# EAGLE design shem_v1.1 (EAGLE 5.09)
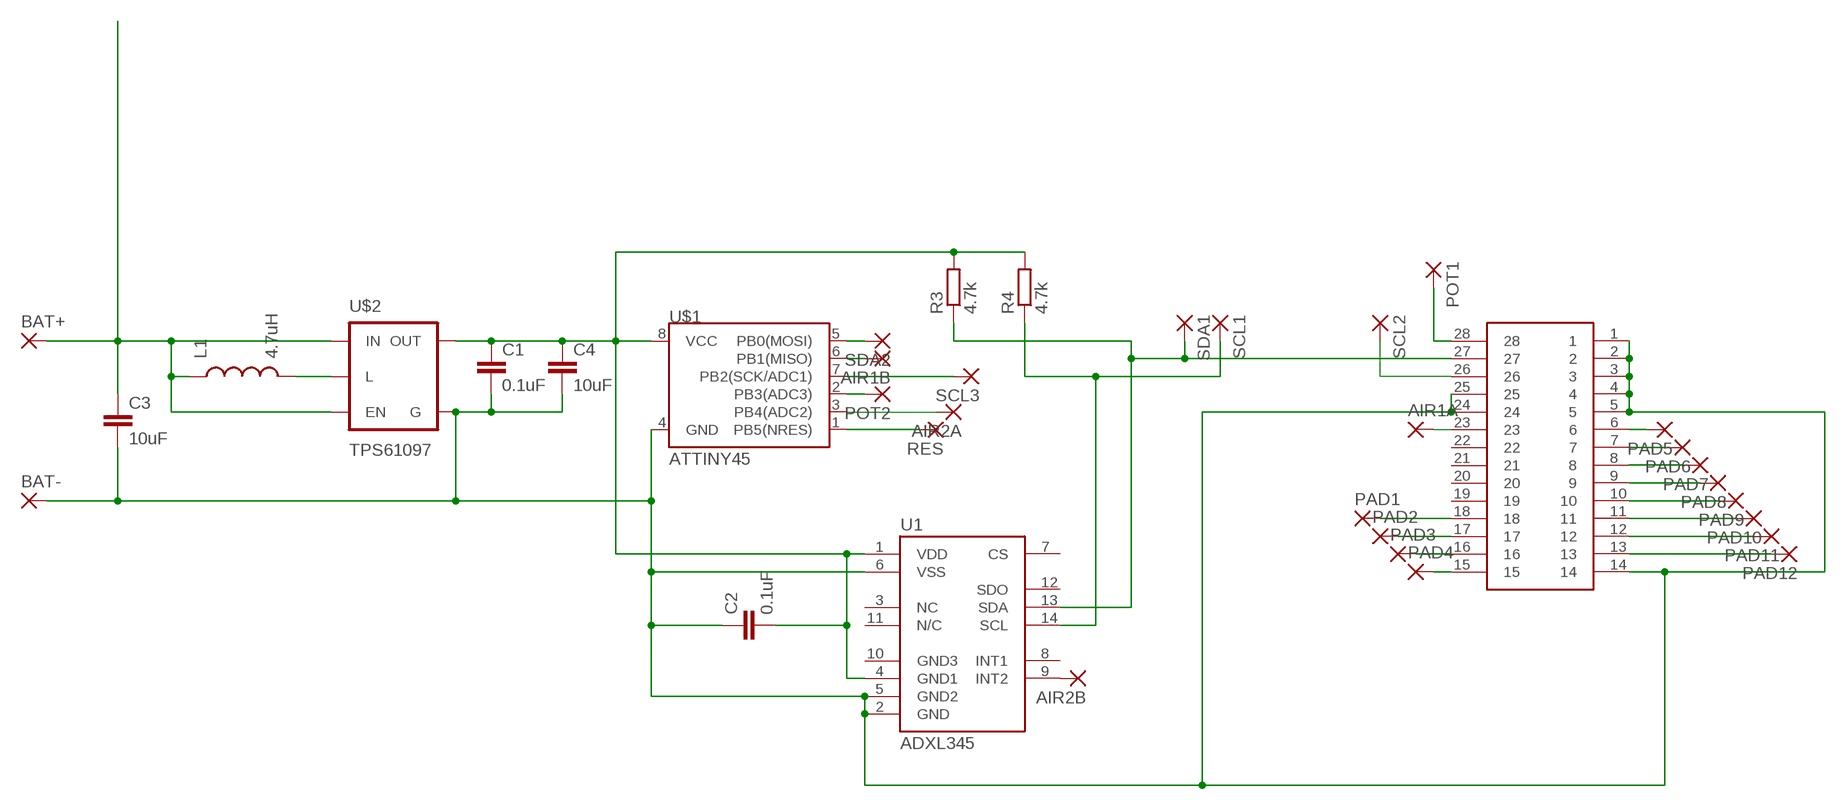
[diagram p0: schematic, sheet 1]

## Parts
AIR1A  SMD5  [SMD2,54-5,08]
AIR1B  SMD5  [SMD2,54-5,08]
AIR2A  SMD5  [SMD2,54-5,08]
AIR2B  SMD5  [SMD2,54-5,08]
BAT+  SMD5  [SMD2,54-5,08]
BAT-  SMD5  [SMD2,54-5,08]
C1  0.1uF  C-EUC1206  [C1206]
C2  0.1uF  C-EUC1206  [C1206]
C3  10uF  C-EUC1206  [C1206]
C4  10uF  C-EUC1206  [C1206]
L1  4.7uH  INDUCTOR1210  [1210]
PAD1  SMD5  [SMD2,54-5,08]
PAD2  SMD5  [SMD2,54-5,08]
PAD3  SMD5  [SMD2,54-5,08]
PAD4  SMD5  [SMD2,54-5,08]
PAD5  SMD5  [SMD2,54-5,08]
PAD6  SMD5  [SMD2,54-5,08]
PAD7  SMD5  [SMD2,54-5,08]
PAD8  SMD5  [SMD2,54-5,08]
PAD9  SMD5  [SMD2,54-5,08]
PAD10  SMD5  [SMD2,54-5,08]
PAD11  SMD5  [SMD2,54-5,08]
PAD12  SMD5  [SMD2,54-5,08]
PCA9635  SSOP28  [SSOP28DB]
POT1  SMD5  [SMD2,54-5,08]
POT2  SMD5  [SMD2,54-5,08]
R3  4.7k  R-EU_M0805  [M0805]
R4  4.7k  R-EU_M0805  [M0805]
RES  SMD5  [SMD2,54-5,08]
SCL1  SMD5  [SMD2,54-5,08]
SCL2  SMD5  [SMD2,54-5,08]
SCL3  SMD5  [SMD2,54-5,08]
SDA1  SMD5  [SMD2,54-5,08]
SDA2  SMD5  [SMD2,54-5,08]
U1  ADXL345  [LGA14]
U$1  ATTINY45  [SO08-EIAJ]
U$2  TPS61097  [SOT23-5]

## Nets
N$1: BAT-.1(P) C1.2 C2.1 C3.2 C4.2 PCA9635.1 PCA9635.2 PCA9635.3 PCA9635.4 PCA9635.5 PCA9635.14 PCA9635.24 PCA9635.25 U1.2(GND) U1.5(GND2) U1.6(VSS) U$1.4(GND) U$2.2(G)
N$2: BAT+.1(P) C3.1 L1.1 U$2.1(IN) U$2.3(EN)
N$3: L1.2 U$2.5(L)
N$4: POT2.1(P) U$1.2(PB3(ADC3))
N$5: C1.1 C2.2 C4.1 R3.2 R4.2 U1.1(VDD) U1.4(GND1) U$1.8(VCC) U$2.4(OUT)
N$6: PCA9635.27 R3.1 SDA1.1(P) U1.13(SDA)
N$7: SCL3.1(P) U$1.7(PB2(SCK/ADC1))
N$8: AIR2B.1(P) U1.9(INT2)
N$9: PCA9635.26 SCL2.1(P)
N$10: PAD5.1(P) PCA9635.6
N$11: PAD6.1(P) PCA9635.7
N$12: PAD7.1(P) PCA9635.8
N$13: PAD8.1(P) PCA9635.9
N$14: PAD9.1(P) PCA9635.10
N$15: PAD10.1(P) PCA9635.11
N$16: PAD11.1(P) PCA9635.12
N$17: PAD12.1(P) PCA9635.13
N$18: PAD1.1(P) PCA9635.18
N$19: PAD2.1(P) PCA9635.17
N$20: PAD3.1(P) PCA9635.16
N$21: PAD4.1(P) PCA9635.15
N$22: RES.1(P) U$1.1(PB5(NRES))
N$23: AIR1A.1(P) PCA9635.23
N$24: AIR2A.1(P) U$1.3(PB4(ADC2))
N$25: R4.1 SCL1.1(P) U1.14(SCL)
N$26: AIR1B.1(P) U$1.6(PB1(MISO))
N$27: PCA9635.28 POT1.1(P)
N$28: SDA2.1(P) U$1.5(PB0(MOSI))
Unconnected: PCA9635.19 PCA9635.20 PCA9635.21 PCA9635.22 U1.3(NC) U1.7(CS) U1.8(INT1) U1.10(GND3) U1.11(N/C) U1.12(SDO)

## Library data of the parts
AIR1A AIR1B AIR2A AIR2B BAT+ BAT- PAD1-PAD12 POT1 POT2 RES SCL1-SCL3 SDA1 SDA2 = wirepad:SMD5: SMD PAD
C1-C4 = resistor:C-EU: CAPACITOR, European symbol
L1 = SparkFun:INDUCTOR: Inductors Basic Inductor/Choke - 0603 and 1206. Footprints are not proven and vary greatly between part numbers.
PCA9635 = SparkFun:SSOP28
R3 R4 = resistor:R-EU_: RESISTOR, European symbol
U1 = SparkFun:ADXL345
U$1 = SparkFun:ATTINY45: Atmel ATTiny45
U$2 = TPS:TPS61097

## Board
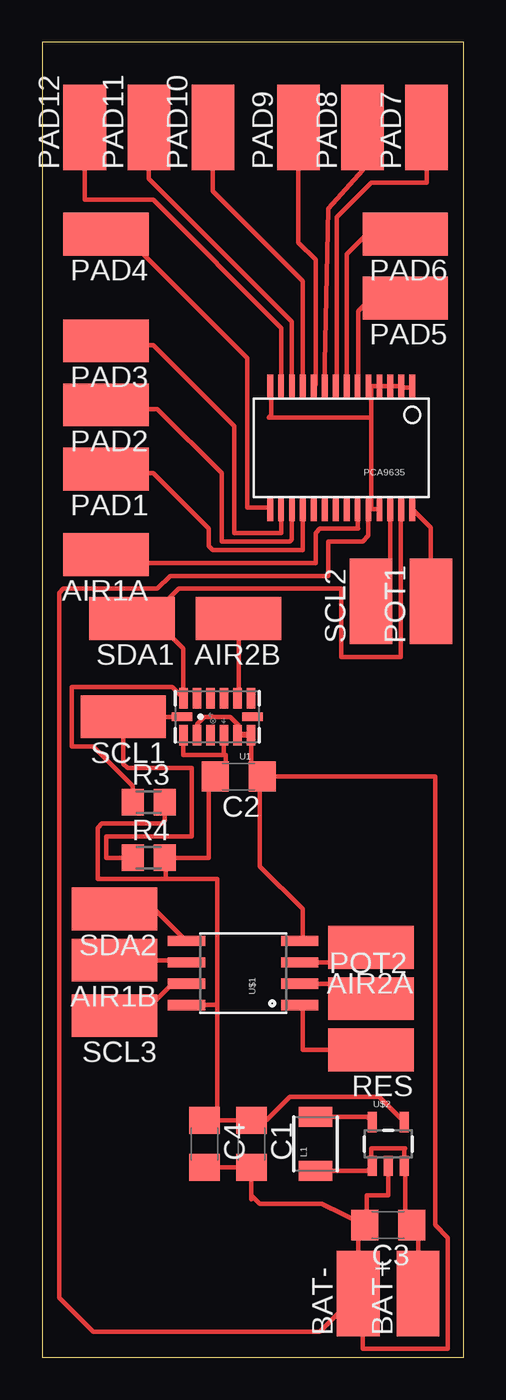
[diagram p1: board, top side]

Size 25.07 x 78.22 mm. Coordinates in mm from the lower left corner, seen from the top.
Outline: 0,0 25.07,0 25.07,78.22 0,78.22 0,0
Copper layers (1*16): Top 0.035mm / dielectric 1.5mm / Bottom 0.035mm
Design rules "default": minimum track width 10mil, minimum drill 24mil, track to track 8mil, track to pad 8mil, pad to pad 8mil, via to via 8mil, smd to smd 8mil, copper to edge 40mil, drill to drill 8mil, minimum pad ring 10mil, minimum via ring 8mil, stop-mask expansion 4mil, vias tented up to drill 0mil, thermal gap 10mil

### Footprints (pad centres in the part's own frame; a part is rotated, then mirrored left to right if it is on the bottom)
SMD2,54-5,08 = smd 2.54 x 5.08: 1 0,0
C1206 = smd 1.6 x 1.8: 1 -1.4,0; 2 1.4,0
1210 = smd 1.2 x 2: 1 -1.6,0; 2 1.6,0
SSOP28DB = smd 0.348 x 1.397: 1 -4.225,-3.656; 2 -3.575,-3.656; 3 -2.925,-3.656; 4 -2.275,-3.656; 5 -1.625,-3.656; 6 -0.975,-3.656; 7 -0.325,-3.656; 8 0.325,-3.656; 9 0.975,-3.656; 10 1.625,-3.656; 11 2.275,-3.656; 12 2.925,-3.656; 13 3.575,-3.656; 14 4.225,-3.656; 15 4.225,3.656; 16 3.575,3.656; 17 2.925,3.656; 18 2.275,3.656; 19 1.625,3.656; 20 0.975,3.656; 21 0.325,3.656; 22 -0.325,3.656; 23 -0.975,3.656; 24 -1.625,3.656; 25 -2.275,3.656; 26 -2.925,3.656; 27 -3.575,3.656; 28 -4.225,3.656
M0805 = smd 1.3 x 1.6: 1 -0.95,0; 2 0.95,0
LGA14 = smd 0.5 x 1.2: 1 2,1.1; 2 1.2,1.1; 3 0.4,1.1; 4 -0.4,1.1; 5 -1.2,1.1; 6 -2,1.1; 8 -2,-1.1; 9 -1.2,-1.1; 10 -0.4,-1.1; 11 0.4,-1.1; 12 1.2,-1.1; 13 2,-1.1 | smd 1.2 x 0.5: 7 -2.1,0; 14 2.1,0
SO08-EIAJ = smd 0.61 x 2.21: 1 -1.905,-3.378; 2 -0.635,-3.378; 3 0.635,-3.378; 4 1.905,-3.378; 5 1.905,3.353; 6 0.635,3.353; 7 -0.635,3.353; 8 -1.905,3.353
SOT23-5 = smd 0.55 x 1.2: 1 -0.95,-1.3; 2 0,-1.3; 3 0.95,-1.3; 4 0.95,1.3; 5 -0.95,1.3

### Placement (x,y rotation side)
AIR1A  3.81,47.75 90 top
AIR1B  4.32,23.62 90 top
AIR2A  19.56,24.38 90 top
AIR2B  11.68,43.94 90 top
BAT+  22.35,3.81 0 top
BAT-  18.8,3.81 0 top
C1  12.45,12.7 270 top
C2  11.68,34.54 180 top
C3  20.57,7.87 180 top
C4  9.65,12.7 270 top
L1  16.26,12.7 90 top
PAD1  3.81,52.83 90 top
PAD2  3.81,56.64 90 top
PAD3  3.81,60.45 90 top
PAD4  3.81,66.8 90 top
PAD5  21.59,62.99 90 top
PAD6  21.59,66.8 90 top
PAD7  22.86,73.15 0 top
PAD8  19.05,73.15 0 top
PAD9  15.24,73.15 0 top
PAD10  10.16,73.15 0 top
PAD11  6.35,73.15 0 top
PAD12  2.54,73.15 0 top
PCA9635  17.78,54.1 180 top
POT1  23.11,44.96 0 top
POT2  19.56,21.34 270 top
R3  6.35,33.02 0 top
R4  6.35,29.72 0 top
RES  19.56,18.29 90 top
SCL1  4.83,38.1 90 top
SCL2  19.56,44.96 0 top
SCL3  4.32,20.32 90 top
SDA1  5.33,43.94 90 top
SDA2  4.32,26.67 90 top
U1  10.41,38.1 180 top
U$1  11.94,22.86 90 top
U$2  20.57,12.7 0 top

### Tracks (layer width: path | path; a pad name or v marks a point on that pad's centre or on a via)
N$1
  Top 0.254: PCA9635.14 13.62,57.76 13.62,56.03 13.46,55.88 19.56,55.88 | 19.56,55.88 19.56,57.61 PCA9635.5 PCA9635.4 PCA9635.3 PCA9635.2 21.36,57.68 21.34,57.66 21.91,57.66 PCA9635.1 | 19.56,55.88 19.56,50.6 PCA9635.24 | PCA9635.24 PCA9635.25 | BAT-.1 18.8,7.5 C3.2 | U$2.2 20.57,9.65 19.3,9.65 19.3,8 C3.2 | C4.2 C1.2 12.45,9.65 | 12.45,9.65 12.95,9.14 16.63,9.14 C3.2 | 12.45,9.65 12.45,9.4 | 12.95,33.78 C2.1 | 12.95,33.78 12.45,34.29 12.45,36.97 U1.6 U1.5 11.68,37.07 11.68,37.08 | 12.95,34.54 12.95,33.78 | PCA9635.24 19.41,48.87 19.05,48.51 17.02,48.51 17.02,46.48 7.62,46.48 6.86,45.72 1.27,45.72 1.02,45.47 1.02,3.56 3.05,1.52 16.51,1.52 BAT-.1 | U1.2 9.21,37.66 9.65,38.1 | 11.18,38.1 9.65,38.1 | 11.68,37.59 11.18,38.1 | 11.68,37.08 11.68,37.59 | 12.95,33.78 12.95,29.21 15.49,26.67 15.49,24.94 U$1.4 | 11.18,38.1 9.65,38.1 | 11.68,37.59 11.18,38.1 | 11.68,37.08 11.68,37.59 | 11.68,37.08 12.45,37.08 12.45,35.05 12.95,34.54 | 12.95,34.54 23.37,34.54 23.37,7.87 24.13,7.11 24.13,0.51 19.05,0.51 19.05,3.56 BAT-.1
N$2
  Top 0.254: BAT+.1 22.35,7.5 C3.1 21.59,8.26 21.59,11.18 21.52,11.24 U$2.3 21.52,12.38 21.59,12.45 19.56,12.45 19.56,11.47 U$2.1 19.32,11.1 L1.1
N$3
  Top 0.254: L1.2 19.32,14.3 U$2.5
N$4
  Top 0.254: U$1.2 17.65,22.23 POT2.1
N$5
  Top 0.254: C4.1 10.16,14.1 | 10.16,14.1 C1.1 13.34,14.1 14.73,15.49 20.03,15.49 U$2.4 | U1.4 10.81,35.92 10.92,35.81 | 10.92,35.81 8.38,35.81 8.38,36.97 U1.1 | 10.92,35.81 10.92,34.42 C2.2 9.91,34.17 9.91,29.72 R4.2 7.37,29.65 7.37,28.45 | R3.2 7.3,31.94 7.11,31.75 3.56,31.75 3.3,31.5 3.3,28.45 7.37,28.45 | U$1.8 10.29,20.96 10.41,21.08 | 10.41,21.08 10.41,14.35 10.16,14.1 | 7.37,28.45 10.41,28.45 10.41,21.08
N$6
  Top 0.254: 6.35,43.94 SDA1.1 | 6.35,43.94 8.13,45.72 17.78,45.72 17.78,41.66 21.34,41.66 21.34,50.43 PCA9635.27 | 6.35,43.94 6.6,43.94 8.38,42.16 8.38,39.23 U1.13 7.74,39.88 1.78,39.88 1.78,36.32 3.05,36.32 5.4,33.97 R3.1
N$7
  Top 0.254: U$1.7 7.75,22.23 6.1,20.57 | 6.1,20.57 5.59,20.57 6.1,20.57 | 6.1,20.57 4.57,20.57 SCL3.1
N$8
  Top 0.254: U1.9 11.61,39.19 11.68,39.12 AIR2B.1
N$9
  Top 0.254: PCA9635.26 20.7,43.82 SCL2.1
N$10
  Top 0.254: PAD5.1 19.56,62.99 18.8,62.23 18.8,57.8 PCA9635.6
N$11
  Top 0.254: PCA9635.7 18.11,65.6 19.81,67.31 21.08,67.31 PAD6.1
N$12
  Top 0.254: PAD7.1 22.86,69.85 19.56,69.85 17.53,67.82 17.53,57.83 PCA9635.8
N$13
  Top 0.254: PAD8.1 19.05,70.61 17.02,68.33 16.76,57.8 PCA9635.9
N$14
  Top 0.254: PAD9.1 15.24,66.29 16.26,65.28 16.26,57.86 PCA9635.10
N$15
  Top 0.254: PCA9635.11 15.51,64 10.16,69.34 PAD10.1
N$16
  Top 0.254: PAD11.1 6.35,70.1 14.86,61.6 PCA9635.12
N$17
  Top 0.254: PAD12.1 2.54,68.83 6.6,68.83 14.22,61.21 14.22,57.78 PCA9635.13
N$18
  Top 0.254: PCA9635.18 15.51,48.02 15.49,48.01 10.16,48.01 9.91,48.26 9.91,49.28 6.6,52.58 4.06,52.58 PAD1.1
N$19
  Top 0.254: PCA9635.17 14.86,48.64 14.73,48.51 10.67,48.51 10.67,52.58 6.86,56.39 4.06,56.39 PAD2.1
N$20
  Top 0.254: PCA9635.16 14.21,49.04 14.22,49.02 11.43,49.02 11.43,55.37 6.6,60.2 4.06,60.2 PAD3.1
N$21
  Top 0.254: PAD4.1 4.83,66.8 12.19,59.44 12.19,50.55 13.46,50.55 PCA9635.15
N$22
  Top 0.254: RES.1 15.49,18.29 15.49,20.78 U$1.1
N$23
  Top 0.254: PCA9635.23 18.75,49.32 18.8,49.28 16.51,49.28 16.26,49.02 16.26,47.24 4.32,47.24 AIR1A.1
N$24
  Top 0.254: U$1.3 18.67,23.5 AIR2A.1
N$25
  Top 0.254: R4.1 3.81,29.72 3.81,30.99 8.89,30.99 8.89,35.05 5.08,35.05 4.83,35.31 SCL1.1 U1.14
N$26
  Top 0.254: AIR1B.1 8.46,23.62 U$1.6
N$27
  Top 0.254: POT1.1 23.11,49.34 PCA9635.28
N$28
  Top 0.254: SDA2.1 6.68,26.67 U$1.5